# Altium schematic sheet 3_waffling60-MXHS-ISO_mcu.SchDoc: =ProjectTitle
size A4; Address1: github.com/4pplet/waffling60; Address2: Licence: CERN-OHL-S; SheetNumber: 3; SheetTotal: 3
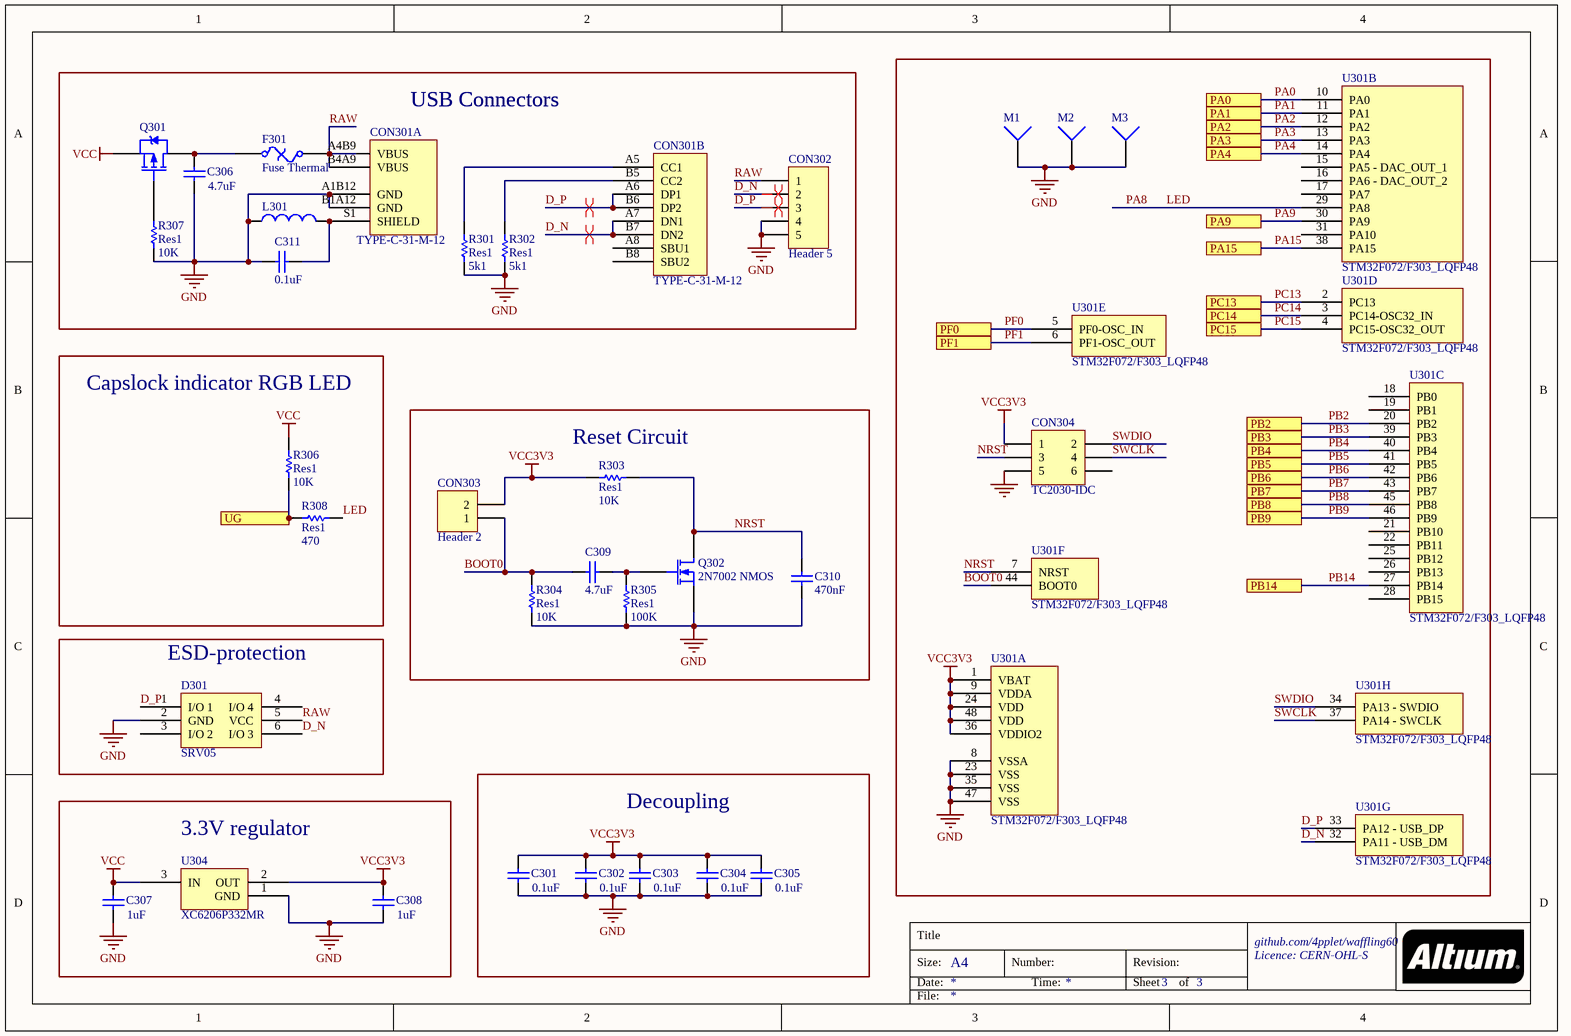
[diagram p0: 3_waffling60-MXHS-ISO_mcu.SchDoc]

## Parts
C301  value 0.1uF  [C0603[1608]]
C302  value 0.1uF  [C0603[1608]]
C303  value 0.1uF  [C0603[1608]]
C304  value 0.1uF  [C0603[1608]]
C305  value 0.1uF  [C0603[1608]]
C306  value 4.7uF  [C0603[1608]]
C307  value 1uF  [C0603[1608]]
C308  value 1uF  [C0603[1608]]
C309  value 4.7uF  [C0603[1608]]
C310  value 470nF  [C0603[1608]]
C311  value 0.1uF  [C0603[1608]]
CON301  TYPE-C-31-M-12  [TYPE-C-31-M-12]  (parts A,B of 2)
CON302  Header 5  [UDB_combo_JST_MOLEX]
CON303  Header 2  [HDR1X2]  (no BOM)
CON304  TC2030-IDC  [TC2030-IDC-NL]  (no BOM)
D301  SRV05  [SOT-23-6]
F301  Fuse Thermal  [C1206[3216]]
L301  Inductor  [L0805]  (value not drawn)
M1  Socket  [mounting_hole]  (value not drawn)  (no BOM)
M2  Socket  [mounting_hole]  (value not drawn)  (no BOM)
M3  Socket  [mounting_hole]  (value not drawn)  (no BOM)
Q301  PMOS-2  [SOT-23-3]  (value not drawn)
Q302  2N7002 NMOS  [SOT-23-3]
R301  Res1  value 5k1  [R0603[1608]]
R302  Res1  value 5k1  [R0603[1608]]
R303  Res1  value 10K  [R0603[1608]]
R304  Res1  value 10K  [R0603[1608]]
R305  Res1  value 100K  [R0603[1608]]
R306  Res1  value 10K  [R0603[1608]]
R307  Res1  value 10K  [R0603[1608]]
R308  Res1  value 470  [R0603[1608]]
U301  STM32F072/F303_LQFP48  [STM32 - COMBO 7X7MM]  (parts A,B,C,D,E,F,G,H of 8)
U304  XC6206P332MR  [SOT-23-3]

## Blocks framed on the sheet
Capslock indicator RGB LED: R306 R308
Reset Circuit: C309 C310 CON303 Q302 R303-R305
ESD-protection: D301
Decoupling: C301-C305
3.3V regulator: C307 C308 U304

## Ports
PA0, PA1, PA2, PA3, PA4, PA9, PA15, PB2, PB3, PB4, PB5, PB6, PB7, PB8, PB9, PB14, PC13, PC14, PC15, PF0, PF1, UG

## Nets
GND: C301.1 C302.1 C303.1 C304.1 C305.1 C306.1 C307.1 C308.1 C310.2 C311.1 CON301.A1B12(GND) CON301.B1A12(GND) CON302.4 CON302.5 CON304.5 D301.2(GND) L301.1 M1.1 M2.1 M3.1 Q302.2(S) R301.2 R302.2 R304.2 R305.2 R307.2 U301.8(VSSA) U301.23(VSS) U301.35(VSS) U301.47(VSS) U304.1(GND)
VCC: C307.2 Q301.2(S) R306.1 U304.3(IN)
VCC3V3: C301.2 C302.2 C303.2 C304.2 C305.2 C308.2 CON303.2 CON304.1 R303.1 U301.1(VBAT) U301.9(VDDA) U301.24(VDD) U301.36(VDDIO2) U301.48(VDD) U304.2(OUT)
BOOT0: C309.1 CON303.1 R304.1 U301.44(BOOT0)
D_N: CON301.A7(DN1) CON301.B7(DN2) CON302.2 D301.6(I/O_3) U301.32(PA11_-_USB_DM)
D_P: CON301.A6(DP1) CON301.B6(DP2) CON302.3 D301.1(I/O_1) U301.33(PA12_-_USB_DP)
LED: R308.2 U301.29(PA8)  [also labelled PA8]
NRST: C310.1 CON304.3 Q302.3(D) R303.2 U301.7(NRST)
PA0: U301.10(PA0) ; port PA0
PA1: U301.11(PA1) ; port PA1
PA2: U301.12(PA2) ; port PA2
PA3: U301.13(PA3) ; port PA3
PA4: U301.14(PA4) ; port PA4
PA9: U301.30(PA9) ; port PA9
PA15: U301.38(PA15) ; port PA15
PB2: U301.20(PB2) ; port PB2
PB3: U301.39(PB3) ; port PB3
PB4: U301.40(PB4) ; port PB4
PB5: U301.41(PB5) ; port PB5
PB6: U301.42(PB6) ; port PB6
PB7: U301.43(PB7) ; port PB7
PB8: U301.45(PB8) ; port PB8
PB9: U301.46(PB9) ; port PB9
PB14: U301.27(PB14) ; port PB14
PC13: U301.2(PC13) ; port PC13
PC14: U301.3(PC14-OSC32_IN) ; port PC14
PC15: U301.4(PC15-OSC32_OUT) ; port PC15
PF0: U301.5(PF0-OSC_IN) ; port PF0
PF1: U301.6(PF1-OSC_OUT) ; port PF1
RAW: CON301.A4B9(VBUS) CON301.B4A9(VBUS) CON302.1 D301.5(VCC) F301.2
SWCLK: CON304.4 U301.37(PA14_-_SWCLK)
SWDIO: CON304.2 U301.34(PA13_-_SWDIO)
UG: R306.2 R308.1 ; port UG
NetC306_2: C306.2 F301.1 Q301.3(D)
NetC309_2: C309.2 Q302.1(G) R305.1
NetC311_2: C311.2 CON301.S1(SHIELD) L301.2
NetCON301_A5: CON301.A5(CC1) R301.1
NetCON301_B5: CON301.B5(CC2) R302.1
NetQ301_1: Q301.1(G) R307.1

Not connected (* = marked no-connect by the designer): CON301 A8(SBU1) B8(SBU2); CON304 6; D301 3(I/O_2) 4(I/O_4); U301 15(PA5_-_DAC_OUT_1) 16(PA6_-_DAC_OUT_2) 17(PA7) 18(PB0) 19(PB1) 21(PB10) 22(PB11) 25(PB12) 26(PB13) 28(PB15) 31(PA10)

## Layout directives
differential pair: D_N, D_P

## Notes on the sheet
- USB Connectors
- Title
- Size:
- Date:
- A4
- Number:
- Time:
- Revision:
- Sheet
- of
- File:

## Library data of the parts
C301-C305 C311 = Cap: Capacitor; MRF.Part: CC0603KRX7R9BB104; LCSC MFG: YAGEO; Version: 0603 imperial; LCSC Part #: C14663
C306 C309 = Cap: Capacitor; MRF.Part: CL10A475KO8NNNC; LCSC MFG: Samsung Electro-Mechanics; Version: 0603 imperial; LCSC Part #: C19666
C307 C308 = Cap: Capacitor; MRF.Part: CL10A105KB8NNNC; LCSC MFG: Samsung Electro-Mechanics; Version: 0603 imperial; LCSC Part #: C15849
C310 = Cap: Capacitor; MRF.Part: CL10B474KA8NNNC; LCSC MFG: Samsung Electro-Mechanics; Version: 0603 imperial; LCSC Part #: C1623
CON301 = TYPE-C-31-M-12: LCSC MFG: Korean Hroparts Elec; LCSC Part #: C165948; MRF.Part: TYPE-C-31-M-12
CON302 = Header 5: JST for USB daughter board; MRF.Part: C145956; LCSC MFG: BOOMELE(Boom Precision Elec); LCSC Part #: C145956
CON303 = Header 2: Header, 2-Pin
CON304 = Header 3X2: Header, 3-Pin, Dual row
D301 = SRV05: MRF.Part: SRV05-4-P-T7; LCSC MFG: ProTek Devices; LCSC Part #: C85364
F301 = Fuse Thermal: Thermal Fuse; MRF.Part: ASMD1206-050; LCSC MFG: Shenzhen JDT Fuse; LCSC Part #: C135338
L301 = Inductor: MRF.Part: GZ2012D101TF; LCSC MFG: Sunlord; LCSC Part #: C1015; Version: 0806 imperial
Q301 = PMOS-2: P-Channel Power MOSFET; MRF.Part: SI2301CDS-T1-GE3; LCSC MFG: Vishay Intertech; LCSC Part #: C10487; Version: SOT23-3
Q302 = MOSFET-N: N-Channel MOSFET; LCSC MFG: Changjiang Electronics Tech (CJ); LCSC Part #: C8545; MRF.Part: 2N7002
R301 R302 = Res1: Resistor; MRF.Part: 0603WAF5101T5E; LCSC MFG: Uniroyal Elec; Version: 0603 imperial; LCSC Part #: C23186
R303 R304 R306 R307 = Res1: Resistor; MRF.Part: 0603WAF1002T5E; LCSC MFG: Uniroyal Elec; Version: 0603 imperial; LCSC Part #: C25804
R305 = Res1: Resistor; MRF.Part: 0603WAF1003T5E; LCSC MFG: Uniroyal Elec; Version: 0603 imperial; LCSC Part #: C25803
R308 = Res1: Resistor; MRF.Part: 0603WAF4700T5E; LCSC MFG: UNI-ROYAL(Uniroyal Elec); Version: 0603 imperial; LCSC Part #: C23179
U301 = STM32F072/F303_LQFP48: MRF.Part: APM32F072CBT6; LCSC MFG: Geehy; LCSC Part #: C915660
U304 = SOT23 LDO: LCSC MFG: Torex Semicon; LCSC Part #: C5446; MRF.Part: XC6206P332MR